# EAGLE design NSR latch (EAGLE 6.1)
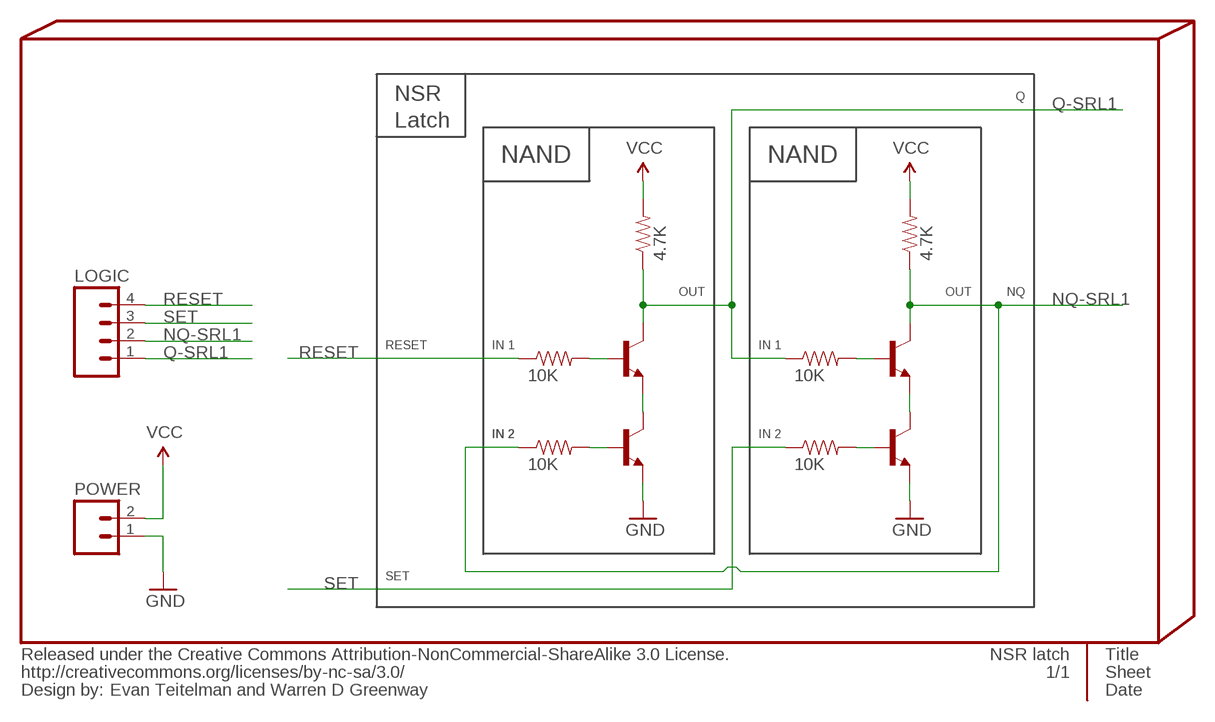
[diagram p0: schematic, sheet 1]

## Parts
INFO4  Evan Teitelman and Warren D Greenway  %CC-NC-SA  [%CC-NC-SA]
LOGIC  M04PTH  [1X04]
POWER  M02PTH  [1X02]
PUR-NAND1  4.7K  RESISTOR0402-RES  [0402-RES]
PUR-NAND2  4.7K  RESISTOR0402-RES  [0402-RES]
Q1-NAND1  TRANSISTOR_NPNSOT23  [SOT23]
Q1-NAND2  TRANSISTOR_NPNSOT23  [SOT23]
Q2-NAND1  TRANSISTOR_NPNSOT23  [SOT23]
Q2-NAND2  TRANSISTOR_NPNSOT23  [SOT23]
R1-NAND1  10K  RESISTOR0402-RES  [0402-RES]
R1-NAND2  10K  RESISTOR0402-RES  [0402-RES]
R2-NAND1  10K  RESISTOR0402-RES  [0402-RES]
R2-NAND2  10K  RESISTOR0402-RES  [0402-RES]

## Nets
GND: POWER.1 Q2-NAND1.2(E) Q2-NAND2.2(E) ; supply symbol labelled @GND
N$3: Q1-NAND2.1(B) R1-NAND2.2
N$4: Q2-NAND2.1(B) R2-NAND1.2
N$5: Q1-NAND1.1(B) R1-NAND1.2
N$6: Q2-NAND1.1(B) R2-NAND2.2
NQ-SRL1: LOGIC.2 PUR-NAND1.1 Q1-NAND1.3(C) R2-NAND1.1
Q-Q-NAND1: Q1-NAND1.2(E) Q2-NAND1.3(C)
Q-Q-NAND2: Q1-NAND2.2(E) Q2-NAND2.3(C)
Q-SRL1: LOGIC.1 PUR-NAND2.1 Q1-NAND2.3(C) R1-NAND1.1
RESET: LOGIC.4 R1-NAND2.1
SET: LOGIC.3 R2-NAND2.1
VCC: POWER.2 PUR-NAND1.2 PUR-NAND2.2 ; supply symbol labelled @VCC

## Notes on the sheet
- NSR | Q
- Latch
- NAND | NAND
- OUT | OUT | NQ
- RESET | IN 1 | IN 1
- IN 2 | IN 2 | IN 2
- SET

## Library data of the parts
INFO4 = PygmyBoards:%CC-NC-SA: Released under the Creative Commons Attribution-NonCommercial-ShareAlike 3.0 License. http://creativecommons.org/licenses/by-sa/3.0 Design by: [Designer Name] Change this part's value to change the designer name
LOGIC = SparkFun:M04: Header 4 Standard 4-pin 0.1" header. Use with straight break away headers (SKU : PRT-00116), right angle break away headers (PRT-00553), swiss pins (PRT-00743), machine pins (PRT-00117), and female headers (PRT-00115). Molex polarized connector foot print use with SKU : PRT-08231 with associated crimp pins and housings. 1MM SMD Version SKU: PRT-10208
POWER = SparkFun:M02: Header 2 Standard 2-pin 0.1" header. Use with straight break away headers (SKU : PRT-00116), right angle break away headers (PRT-00553), swiss pins (PRT-00743), machine pins (PRT-00117), and female headers (PRT-00115). Molex polarized connector foot print use with SKU : PRT-08233 with associated crimp pins and housings.
PUR-NAND1 PUR-NAND2 R1-NAND1 R1-NAND2 R2-NAND1 R2-NAND2 = SparkFun:RESISTOR: Resistor Basic schematic elements and footprints for 0603, 1206, and PTH resistors.
Q1-NAND1 Q1-NAND2 Q2-NAND1 Q2-NAND2 = SparkFun:TRANSISTOR_NPN: Transistor NPN BJT configuration in SOT23 package. MMBT2222 is the common NPN we use. Double check BCE configuration again layout.

## Board
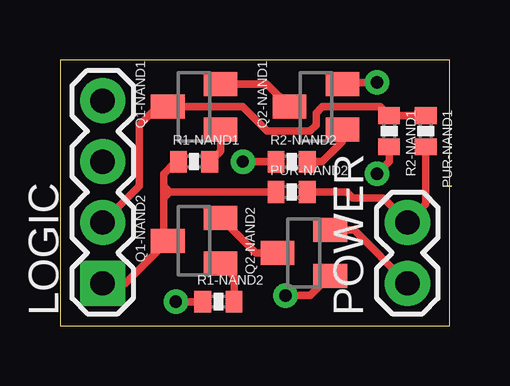
[diagram p1: board, top side]
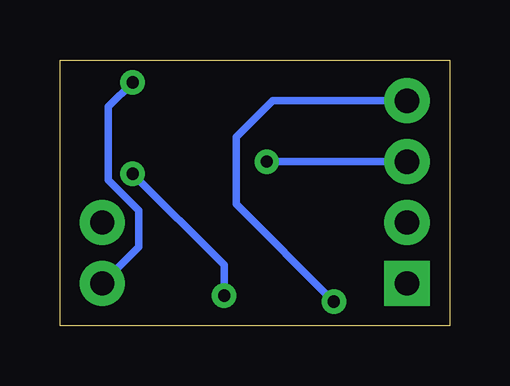
[diagram p2: board, bottom side, seen from below]

Size 16.24 x 11.1 mm. Coordinates in mm from the lower left corner, seen from the top.
Outline: 0,0 16.24,0 16.24,11.1 0,11.1 0,0
Copper layers (1*16): Top 0.035mm / dielectric 1.5mm / Bottom 0.035mm
Design rules: minimum track width 8mil, minimum drill 20mil, track to track 8mil, track to pad 8mil, pad to pad 4mil, via to via 8mil, smd to smd 4mil, copper to edge 15mil, drill to drill 8mil, minimum pad ring 12mil, minimum via ring 10mil, stop-mask expansion 4mil, vias tented up to drill 25mil, thermal gap 10mil

### Footprints (pad centres in the part's own frame; a part is rotated, then mirrored left to right if it is on the bottom)
1X04 = drill 1.016 pad 1.88 square: 1 0,0 | drill 1.016 pad 1.88: 2 2.54,0; 3 5.08,0; 4 7.62,0
1X02 = drill 1.016 pad 1.88: 1 0,0; 2 2.54,0
0402-RES = smd 0.7 x 0.9: 1 -0.65,0; 2 0.65,0
SOT23 = smd 1 x 1.4: 1 -0.95,-1.1; 2 0.95,-1.1; 3 0,1.1

### Placement (x,y rotation side)
INFO4  0,-7.62 0 top  (outside the outline)
LOGIC  1.78,1.78 90 top
POWER  14.48,1.78 90 top
PUR-NAND1  15.24,8.13 270 top
PUR-NAND2  9.65,5.59 0 top
Q1-NAND1  5.59,9.14 90 top
Q1-NAND2  5.59,3.56 90 top
Q2-NAND1  10.67,9.14 90 top
Q2-NAND2  10.16,3.05 90 top
R1-NAND1  5.59,6.86 0 top
R1-NAND2  6.6,1.02 0 top
R2-NAND1  13.72,8.13 270 top
R2-NAND2  9.65,6.86 0 top

### Tracks (layer width: path | path; a pad name or v marks a point on that pad's centre or on a via)
GND  (via drill 0.51)
  Top 0.305: Q2-NAND1.2 11.83,10.16 v13.21,10.16 | Q2-NAND2.2 12.26,4 POWER.1
  Bottom 0.305: v13.21,10.16 14.22,9.14 14.22,6.1 12.95,4.83 12.95,3.3 POWER.1
N$3
  Top 0.305: Q1-NAND2.1 7.25,2.04 R1-NAND2.2
N$4  (via drill 0.51)
  Top 0.305: R2-NAND1.2 13.72,6.86 v13.21,6.35 | v9.4,1.27 10.43,1.27 Q2-NAND2.1
  Bottom 0.305: v9.4,1.27 9.4,2.54 v13.21,6.35
N$5
  Top 0.305: R1-NAND1.2 6.69,7.31 Q1-NAND1.1
N$6
  Top 0.305: Q2-NAND1.1 11.77,7.7 10.92,6.86 R2-NAND2.2
NQ-SRL1
  Top 0.305: PUR-NAND1.1 R2-NAND1.1 13.35,9.14 10.92,9.14 10.67,8.89 10.67,8.38 10.41,8.13 8.64,8.13 7.62,9.14 Q1-NAND1.3 4.06,9.14 3.3,8.38 3.3,5.84 LOGIC.2
Q-Q-NAND1
  Top 0.305: Q1-NAND1.2 8.62,10.09 Q2-NAND1.3
Q-Q-NAND2
  Top 0.305: Q1-NAND2.2 8.15,3.05 Q2-NAND2.3
Q-SRL1
  Top 0.305: Q1-NAND2.3 4.43,3.61 | LOGIC.1 2.71,1.78 Q1-NAND2.3 | R1-NAND1.1 4.83,6.86 4.32,6.35 4.32,5.84 | 4.32,5.33 4.32,3.73 Q1-NAND2.3 | 4.32,5.33 4.32,5.59 | 4.32,5.59 4.32,5.84 | 4.32,5.59 4.57,5.59 | 4.57,5.59 PUR-NAND2.1 | 4.57,5.59 4.32,5.84 | 4.32,5.33 4.57,5.59
RESET  (via drill 0.51)
  Top 0.305: v4.83,1.02 R1-NAND2.1
  Bottom 0.305: v4.83,1.02 8.89,5.08 8.89,7.87 7.37,9.4 LOGIC.4
SET  (via drill 0.51)
  Top 0.305: v7.62,6.86 R2-NAND2.1
  Bottom 0.305: LOGIC.3 v7.62,6.86
VCC
  Top 0.305: PUR-NAND1.2 15.24,5.08 POWER.2 13.46,5.33 12.19,5.33 11.94,5.59 PUR-NAND2.2